# Altium schematic sheet Channel Confifuration.SchDoc
size B
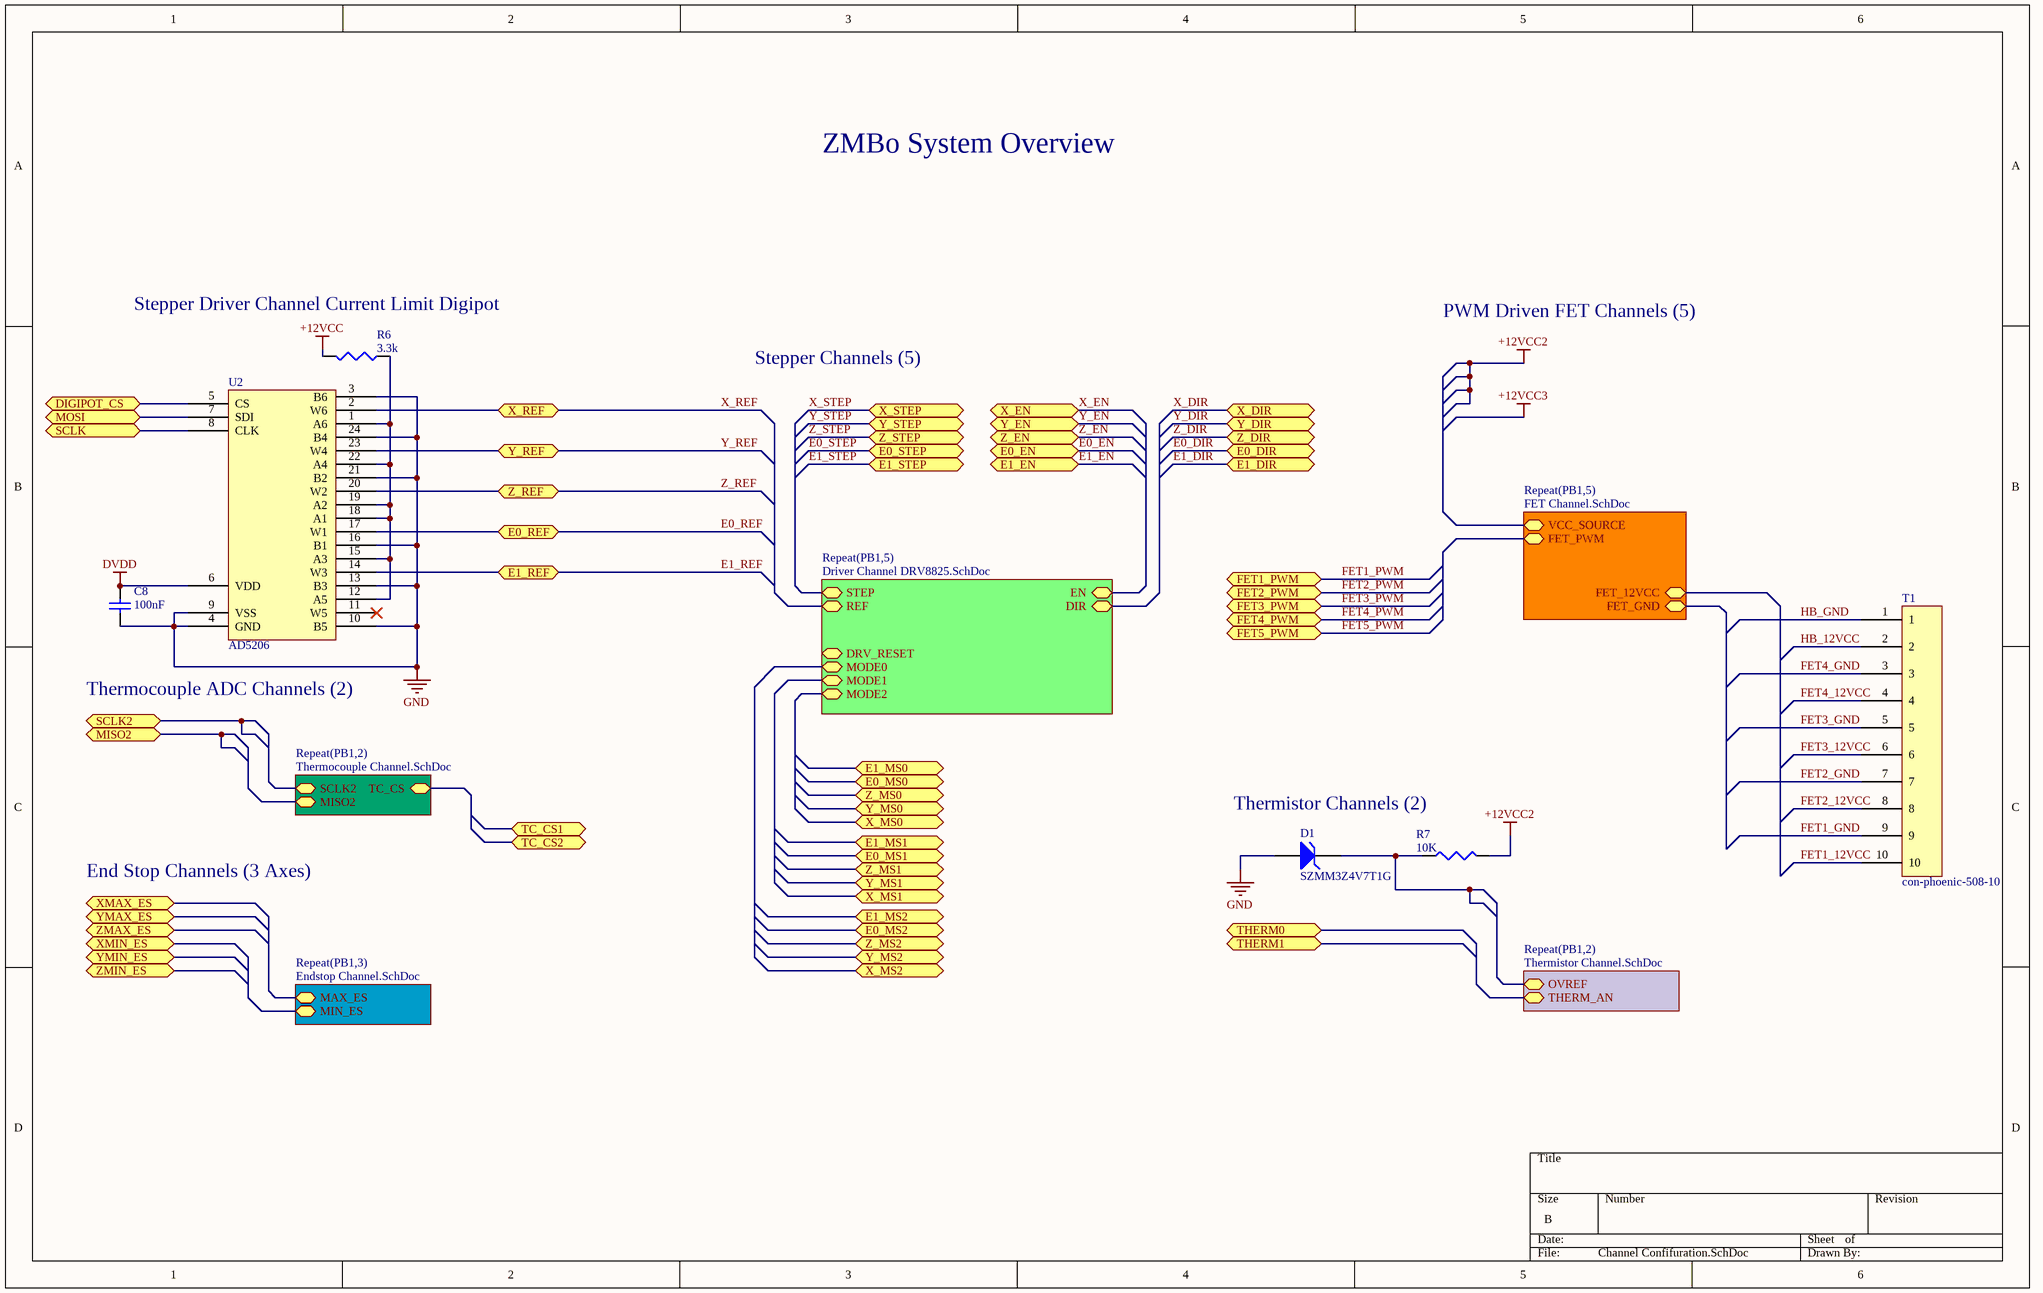
[diagram p0: Channel Confifuration.SchDoc]

## Parts
C8  value 100nF  [1608[0603]]  (hidden comment: Cap Semi)
D1  SZMM3Z4V7T1G  [SZMM3Z4V7T1G]
R6  value 3.3k  [J1-0603]  (hidden comment: Res3)
R7  value 10K  [J1-0603]  (hidden comment: Res3)
T1  con-phoenic-508-10  [con-phoenix-508 - 10]
U2  AD5206  [AD5206 & AD5204]

## Sub-sheets
Repeat(PB1,2) = Thermocouple Channel.SchDoc: SCLK2, MISO2, TC_CS
Repeat(PB1,2) = Thermistor Channel.SchDoc: OVREF, THERM_AN
Repeat(PB1,3) = Endstop Channel.SchDoc: MAX_ES, MIN_ES
Repeat(PB1,5) = FET Channel.SchDoc: FET_PWM, FET_12VCC, FET_GND, VCC_SOURCE
Repeat(PB1,5) = Driver Channel DRV8825.SchDoc: EN, DIR, STEP, REF, DRV_RESET, MODE0, MODE1, MODE2

## Ports
DIGIPOT_CS, E0_DIR, E0_EN, E0_MS0, E0_MS1, E0_MS2, E0_REF, E0_STEP, E1_DIR, E1_EN, E1_MS0, E1_MS1, E1_MS2, E1_REF, E1_STEP, FET1_PWM, FET2_PWM, FET3_PWM, FET4_PWM, FET5_PWM, MISO2, MOSI, SCLK, SCLK2, TC_CS1, TC_CS2, THERM0, THERM1, X_DIR, X_EN, X_MS0, X_MS1, X_MS2, X_REF, X_STEP, XMAX_ES, XMIN_ES, Y_DIR, Y_EN, Y_MS0, Y_MS1, Y_MS2, Y_REF, Y_STEP, YMAX_ES, YMIN_ES, Z_DIR, Z_EN, Z_MS0, Z_MS1, Z_MS2, Z_REF, Z_STEP, ZMAX_ES, ZMIN_ES

## Nets
+12VCC: R6.2
+12VCC2: R7.2
DVDD: C8.2 U2.6(VDD)
GND: C8.1 D1.1(A) U2.3(B6) U2.4(GND) U2.9(VSS) U2.10(B5) U2.13(B3) U2.16(B1) U2.21(B2) U2.24(B4)
DIGIPOT_CS: U2.5(CS) ; port DIGIPOT_CS
E0_DIR: port E0_DIR
E0_EN: port E0_EN
E0_REF: U2.17(W1) ; port E0_REF
E0_STEP: port E0_STEP
E1_DIR: port E1_DIR
E1_EN: port E1_EN
E1_REF: U2.14(W3) ; port E1_REF
E1_STEP: port E1_STEP
FET1_12VCC: T1.10
FET1_GND: T1.9
FET1_PWM: port FET1_PWM
FET2_12VCC: T1.8
FET2_GND: T1.7
FET2_PWM: port FET2_PWM
FET3_12VCC: T1.6
FET3_GND: T1.5
FET3_PWM: port FET3_PWM
FET4_12VCC: T1.4
FET4_GND: T1.3
FET4_PWM: port FET4_PWM
FET5_PWM: port FET5_PWM
HB_12VCC: T1.2
HB_GND: T1.1
MOSI: U2.7(SDI) ; port MOSI
SCLK: U2.8(CLK) ; port SCLK
X_DIR: port X_DIR
X_EN: port X_EN
X_REF: U2.2(W6) ; port X_REF
X_STEP: port X_STEP
Y_DIR: port Y_DIR
Y_EN: port Y_EN
Y_REF: U2.23(W4) ; port Y_REF
Y_STEP: port Y_STEP
Z_DIR: port Z_DIR
Z_EN: port Z_EN
Z_REF: U2.20(W2) ; port Z_REF
Z_STEP: port Z_STEP
NetD1_2: D1.2(K) R7.1
NetR6_1: R6.1 U2.1(A6) U2.12(A5) U2.15(A3) U2.18(A1) U2.19(A2) U2.22(A4)

Not connected (* = marked no-connect by the designer): U2 11(W5)*

## Notes on the sheet
- ZMBo System Overview
- (near R6) Stepper Driver Channel Current Limit Digipot
- Stepper Channels (5)
- PWM Driven FET Channels (5)
- Thermocouple ADC Channels (2)
- Thermistor Channels (2)
- End Stop Channels (3 Axes)

## Library data of the parts
C8 = Cap Semi: Capacitor (Semiconductor SIM Model); Published: 8-Jun-2000; LatestRevisionDate: 29-May-2009; LatestRevisionNote: IPC-7351 Footprint Added.; PackageReference: C1206; Publisher: Altium Limited; PackageDescription: Chip Capacitor
D1 = D Zener: Zener Diode; Published: 8-Jun-2000; LatestRevisionDate: 17-Jul-2002; LatestRevisionNote: Re-released for DXP Platform.; PackageReference: DIODE-0.7; Publisher: Altium Limited; PackageDescription: Diode, Thru-Hole; 2 Leads; 0.7 in Pin Spacing
R6 R7 = Res3: Resistor; Published: 8-Jun-2000; LatestRevisionDate: 29-May-2009; LatestRevisionNote: IPC-7351 Footprint Added.; PackageReference: J1-0603; Publisher: Altium Limited; PackageDescription: Chip Resistor